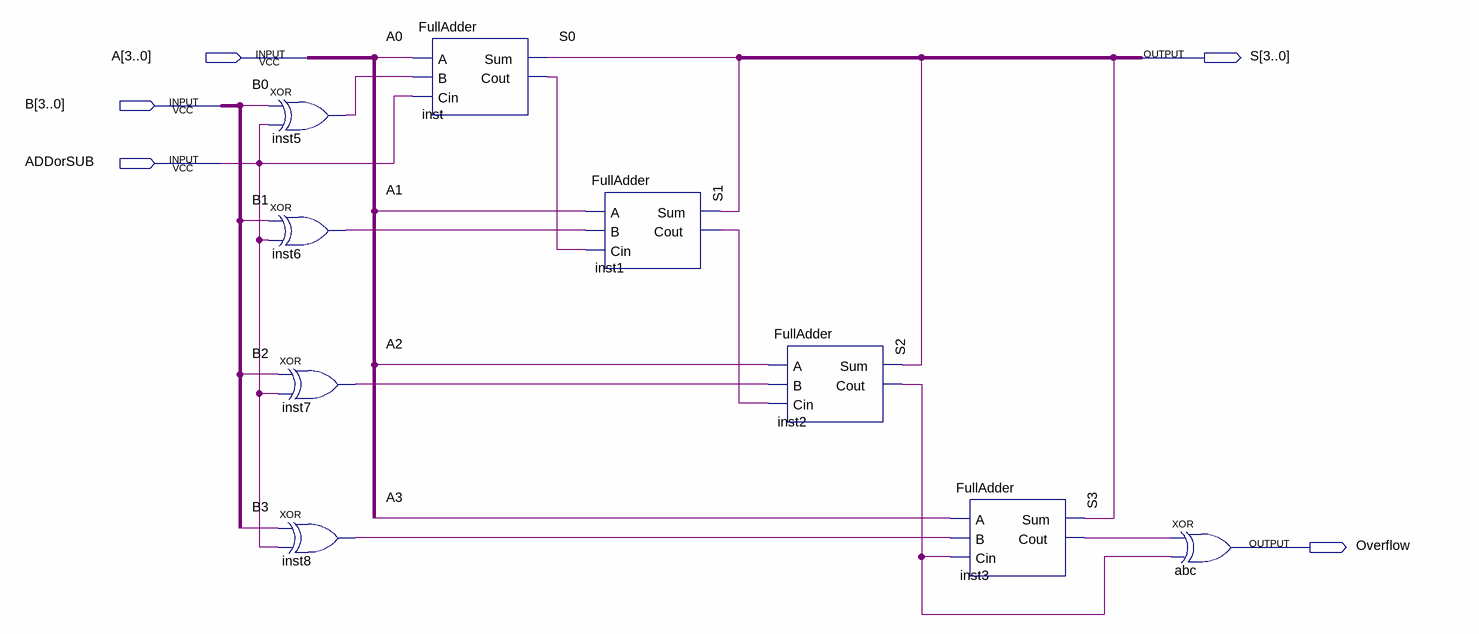
[diagram p0: schematic sheet]
// Quartus schematic AddSub4.bdf as structural Verilog: 9 symbols, 5 pins
module AddSub4 (
  input  [3:0] A,
  input  [3:0] B,
  input  ADDorSUB,
  output [3:0] S,
  output Overflow
);

  wire inst1_cout, inst2_cout, inst3_cout, inst5_out, inst6_out, inst7_out, inst8_out, inst_cout;

  xor inst5 (inst5_out, B[0], ADDorSUB);
  xor inst6 (inst6_out, B[1], ADDorSUB);
  xor inst7 (inst7_out, B[2], ADDorSUB);
  xor inst8 (inst8_out, B[3], ADDorSUB);
  FullAdder inst (.A(A[0]), .B(inst5_out), .Cin(ADDorSUB), .Sum(S[0]), .Cout(inst_cout));
  FullAdder inst1 (.A(A[1]), .B(inst6_out), .Cin(inst_cout), .Sum(S[1]), .Cout(inst1_cout));
  FullAdder inst2 (.A(A[2]), .B(inst7_out), .Cin(inst1_cout), .Sum(S[2]), .Cout(inst2_cout));
  FullAdder inst3 (.A(A[3]), .B(inst8_out), .Cin(inst2_cout), .Sum(S[3]), .Cout(inst3_cout));
  xor abc (Overflow, inst3_cout, inst2_cout);
endmodule
